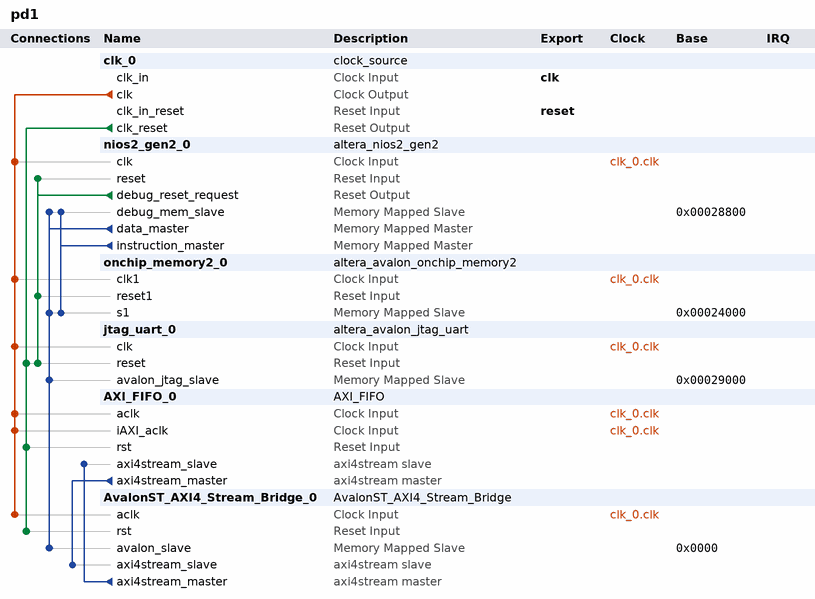
[diagram p0: system contents]
# Platform Designer (Qsys) system pd1, Cyclone IV E EP4CE6E22C8
# Parameters at their usual value, and those the tool derives, are not listed.
package require -exact qsys 21.1
create_system pd1
set_project_property DEVICE_FAMILY {Cyclone IV E}
set_project_property DEVICE EP4CE6E22C8

add_instance clk_0 clock_source 21.1
set_instance_parameter_value clk_0 clockFrequency 50000000

add_instance nios2_gen2_0 altera_nios2_gen2 21.1
set_instance_parameter_value nios2_gen2_0 dcache_size 2048
set_instance_parameter_value nios2_gen2_0 exceptionSlave onchip_memory2_0.s1
set_instance_parameter_value nios2_gen2_0 icache_size 4096
set_instance_parameter_value nios2_gen2_0 impl Tiny
set_instance_parameter_value nios2_gen2_0 resetSlave onchip_memory2_0.s1

add_instance onchip_memory2_0 altera_avalon_onchip_memory2 21.1
set_instance_parameter_value onchip_memory2_0 dataWidth 16
set_instance_parameter_value onchip_memory2_0 dualPort false
set_instance_parameter_value onchip_memory2_0 initMemContent true
set_instance_parameter_value onchip_memory2_0 initializationFileName onchip_mem.hex
set_instance_parameter_value onchip_memory2_0 memorySize 16384

add_instance jtag_uart_0 altera_avalon_jtag_uart 21.1
set_instance_parameter_value jtag_uart_0 simInteractiveOptions NO_INTERACTIVE_WINDOWS

add_instance AXI_FIFO_0 AXI_FIFO 1.0
set_instance_parameter_value AXI_FIFO_0 FIFO_DEPTH 10
set_instance_parameter_value AXI_FIFO_0 FIFO_WIDTH 2

add_instance AvalonST_AXI4_Stream_Bridge_0 AvalonST_AXI4_Stream_Bridge 1.0
set_instance_parameter_value AvalonST_AXI4_Stream_Bridge_0 FIFO_DEPTH 10
set_instance_parameter_value AvalonST_AXI4_Stream_Bridge_0 FIFO_WIDTH 2

# connections
add_connection clk_0.clk AvalonST_AXI4_Stream_Bridge_0.aclk clock
add_connection clk_0.clk AXI_FIFO_0.aclk clock
add_connection clk_0.clk AXI_FIFO_0.iAXI_aclk clock
add_connection clk_0.clk jtag_uart_0.clk clock
add_connection clk_0.clk nios2_gen2_0.clk clock
add_connection clk_0.clk onchip_memory2_0.clk1 clock
add_connection clk_0.clk_reset AvalonST_AXI4_Stream_Bridge_0.rst reset
add_connection clk_0.clk_reset AXI_FIFO_0.rst reset
add_connection clk_0.clk_reset jtag_uart_0.reset reset
add_connection nios2_gen2_0.debug_reset_request jtag_uart_0.reset reset
add_connection nios2_gen2_0.debug_reset_request nios2_gen2_0.reset reset
add_connection nios2_gen2_0.debug_reset_request onchip_memory2_0.reset1 reset
add_connection nios2_gen2_0.data_master AvalonST_AXI4_Stream_Bridge_0.avalon_slave avalon
set_connection_parameter_value nios2_gen2_0.data_master/AvalonST_AXI4_Stream_Bridge_0.avalon_slave baseAddress 0x0000
add_connection nios2_gen2_0.data_master jtag_uart_0.avalon_jtag_slave avalon
set_connection_parameter_value nios2_gen2_0.data_master/jtag_uart_0.avalon_jtag_slave baseAddress 0x00029000
add_connection nios2_gen2_0.data_master nios2_gen2_0.debug_mem_slave avalon
set_connection_parameter_value nios2_gen2_0.data_master/nios2_gen2_0.debug_mem_slave baseAddress 0x00028800
add_connection nios2_gen2_0.data_master onchip_memory2_0.s1 avalon
set_connection_parameter_value nios2_gen2_0.data_master/onchip_memory2_0.s1 baseAddress 0x00024000
add_connection nios2_gen2_0.instruction_master nios2_gen2_0.debug_mem_slave avalon
set_connection_parameter_value nios2_gen2_0.instruction_master/nios2_gen2_0.debug_mem_slave baseAddress 0x00028800
add_connection nios2_gen2_0.instruction_master onchip_memory2_0.s1 avalon
set_connection_parameter_value nios2_gen2_0.instruction_master/onchip_memory2_0.s1 baseAddress 0x00024000
add_connection AvalonST_AXI4_Stream_Bridge_0.axi4stream_master AXI_FIFO_0.axi4stream_slave axi4stream
add_connection AXI_FIFO_0.axi4stream_master AvalonST_AXI4_Stream_Bridge_0.axi4stream_slave axi4stream

# exported interfaces
add_interface clk clock sink
set_interface_property clk EXPORT_OF clk_0.clk_in
add_interface reset reset sink
set_interface_property reset EXPORT_OF clk_0.clk_in_reset

set_interconnect_requirement {$system} qsys_mm.clockCrossingAdapter HANDSHAKE
set_interconnect_requirement {$system} qsys_mm.enableEccProtection FALSE
set_interconnect_requirement {$system} qsys_mm.insertDefaultSlave FALSE
set_interconnect_requirement {$system} qsys_mm.maxAdditionalLatency 1

save_system pd1.qsys
